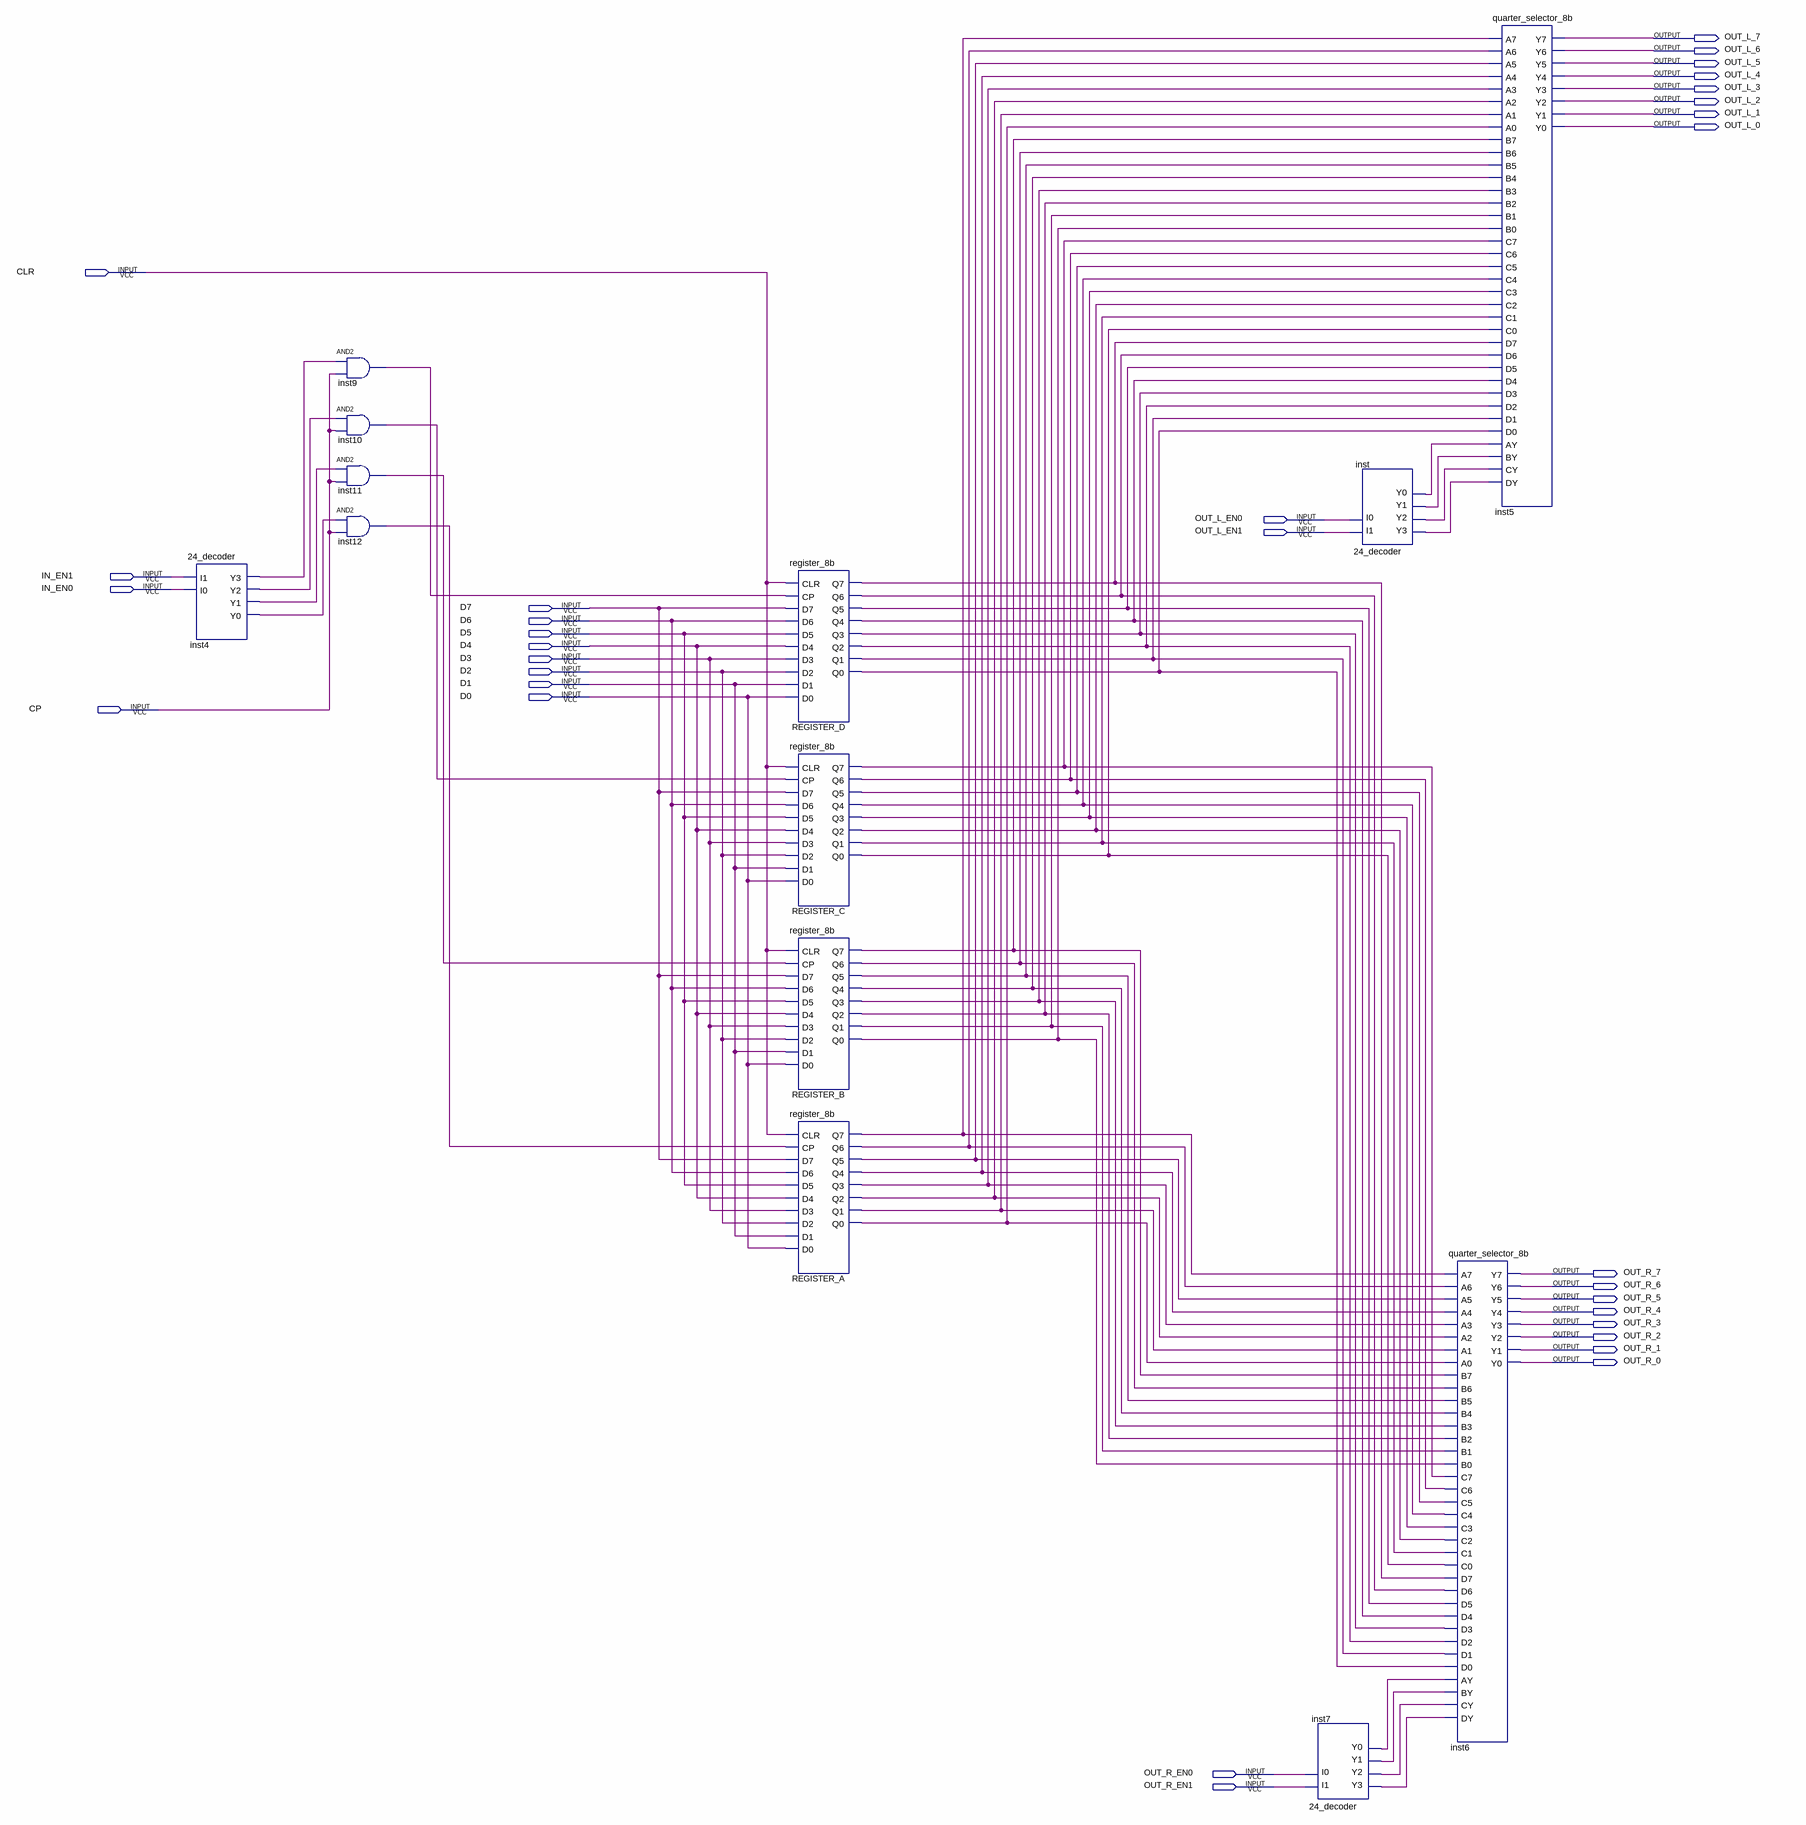
[diagram p0: schematic sheet]
// Quartus schematic register_4x.bdf as structural Verilog: 13 symbols, 32 pins
module register_4x (
  input  CLR,
  input  OUT_L_EN0,
  input  OUT_L_EN1,
  input  IN_EN1,
  input  IN_EN0,
  input  D7,
  input  D6,
  input  D5,
  input  D4,
  input  D3,
  input  D2,
  input  D1,
  input  D0,
  input  CP,
  input  OUT_R_EN0,
  input  OUT_R_EN1,
  output OUT_L_7,
  output OUT_L_6,
  output OUT_L_5,
  output OUT_L_4,
  output OUT_L_3,
  output OUT_L_2,
  output OUT_L_1,
  output OUT_L_0,
  output OUT_R_7,
  output OUT_R_6,
  output OUT_R_5,
  output OUT_R_4,
  output OUT_R_3,
  output OUT_R_2,
  output OUT_R_1,
  output OUT_R_0
);

  wire inst4_y0, inst4_y1, inst4_y2, inst4_y3, inst7_y0, inst7_y1, inst7_y2, inst7_y3, inst9_out, inst10_out,
       inst11_out, inst12_out, inst_y0, inst_y1, inst_y2, inst_y3, REGISTER_A_q0, REGISTER_A_q1,
       REGISTER_A_q2, REGISTER_A_q3, REGISTER_A_q4, REGISTER_A_q5, REGISTER_A_q6, REGISTER_A_q7,
       REGISTER_B_q0, REGISTER_B_q1, REGISTER_B_q2, REGISTER_B_q3, REGISTER_B_q4, REGISTER_B_q5,
       REGISTER_B_q6, REGISTER_B_q7, REGISTER_C_q0, REGISTER_C_q1, REGISTER_C_q2, REGISTER_C_q3,
       REGISTER_C_q4, REGISTER_C_q5, REGISTER_C_q6, REGISTER_C_q7, REGISTER_D_q0, REGISTER_D_q1,
       REGISTER_D_q2, REGISTER_D_q3, REGISTER_D_q4, REGISTER_D_q5, REGISTER_D_q6, REGISTER_D_q7;

  \24_decoder  inst4 (.I1(IN_EN1), .I0(IN_EN0), .Y3(inst4_y3), .Y2(inst4_y2), .Y1(inst4_y1), .Y0(inst4_y0));
  and inst9 (inst9_out, inst4_y3, CP);
  and inst10 (inst10_out, inst4_y2, CP);
  and inst11 (inst11_out, inst4_y1, CP);
  and inst12 (inst12_out, inst4_y0, CP);
  register_8b REGISTER_D (
    .CLR(CLR), .CP(inst9_out), .D7(D7), .D6(D6), .D5(D5), .D4(D4), .D3(D3), .D2(D2), .D1(D1), .D0(D0),
    .Q7(REGISTER_D_q7), .Q6(REGISTER_D_q6), .Q5(REGISTER_D_q5), .Q4(REGISTER_D_q4), .Q3(REGISTER_D_q3),
    .Q2(REGISTER_D_q2), .Q1(REGISTER_D_q1), .Q0(REGISTER_D_q0));
  register_8b REGISTER_C (
    .CLR(CLR), .CP(inst10_out), .D7(D7), .D6(D6), .D5(D5), .D4(D4), .D3(D3), .D2(D2), .D1(D1), .D0(D0),
    .Q7(REGISTER_C_q7), .Q6(REGISTER_C_q6), .Q5(REGISTER_C_q5), .Q4(REGISTER_C_q4), .Q3(REGISTER_C_q3),
    .Q2(REGISTER_C_q2), .Q1(REGISTER_C_q1), .Q0(REGISTER_C_q0));
  register_8b REGISTER_B (
    .CLR(CLR), .CP(inst11_out), .D7(D7), .D6(D6), .D5(D5), .D4(D4), .D3(D3), .D2(D2), .D1(D1), .D0(D0),
    .Q7(REGISTER_B_q7), .Q6(REGISTER_B_q6), .Q5(REGISTER_B_q5), .Q4(REGISTER_B_q4), .Q3(REGISTER_B_q3),
    .Q2(REGISTER_B_q2), .Q1(REGISTER_B_q1), .Q0(REGISTER_B_q0));
  register_8b REGISTER_A (
    .CLR(CLR), .CP(inst12_out), .D7(D7), .D6(D6), .D5(D5), .D4(D4), .D3(D3), .D2(D2), .D1(D1), .D0(D0),
    .Q7(REGISTER_A_q7), .Q6(REGISTER_A_q6), .Q5(REGISTER_A_q5), .Q4(REGISTER_A_q4), .Q3(REGISTER_A_q3),
    .Q2(REGISTER_A_q2), .Q1(REGISTER_A_q1), .Q0(REGISTER_A_q0));
  \24_decoder  inst7 (.I1(OUT_R_EN1), .I0(OUT_R_EN0), .Y3(inst7_y3), .Y2(inst7_y2), .Y1(inst7_y1), .Y0(inst7_y0));
  \24_decoder  inst (.I1(OUT_L_EN1), .I0(OUT_L_EN0), .Y3(inst_y3), .Y2(inst_y2), .Y1(inst_y1), .Y0(inst_y0));
  quarter_selector_8b inst6 (
    .A7(REGISTER_A_q7), .A6(REGISTER_A_q6), .A5(REGISTER_A_q5), .A4(REGISTER_A_q4), .A3(REGISTER_A_q3),
    .A2(REGISTER_A_q2), .A1(REGISTER_A_q1), .A0(REGISTER_A_q0), .B7(REGISTER_B_q7), .B6(REGISTER_B_q6),
    .B5(REGISTER_B_q5), .B4(REGISTER_B_q4), .B3(REGISTER_B_q3), .B2(REGISTER_B_q2), .B1(REGISTER_B_q1),
    .B0(REGISTER_B_q0), .AY(inst7_y0), .BY(inst7_y1), .C7(REGISTER_C_q7), .C6(REGISTER_C_q6),
    .C5(REGISTER_C_q5), .C4(REGISTER_C_q4), .C3(REGISTER_C_q3), .C2(REGISTER_C_q2), .C1(REGISTER_C_q1),
    .C0(REGISTER_C_q0), .D7(REGISTER_D_q7), .D6(REGISTER_D_q6), .D5(REGISTER_D_q5), .D4(REGISTER_D_q4),
    .D3(REGISTER_D_q3), .D2(REGISTER_D_q2), .D1(REGISTER_D_q1), .D0(REGISTER_D_q0), .CY(inst7_y2),
    .DY(inst7_y3), .Y7(OUT_R_7), .Y6(OUT_R_6), .Y5(OUT_R_5), .Y4(OUT_R_4), .Y3(OUT_R_3), .Y2(OUT_R_2),
    .Y1(OUT_R_1), .Y0(OUT_R_0));
  quarter_selector_8b inst5 (
    .A7(REGISTER_A_q7), .A6(REGISTER_A_q6), .A5(REGISTER_A_q5), .A4(REGISTER_A_q4), .A3(REGISTER_A_q3),
    .A2(REGISTER_A_q2), .A1(REGISTER_A_q1), .A0(REGISTER_A_q0), .B7(REGISTER_B_q7), .B6(REGISTER_B_q6),
    .B5(REGISTER_B_q5), .B4(REGISTER_B_q4), .B3(REGISTER_B_q3), .B2(REGISTER_B_q2), .B1(REGISTER_B_q1),
    .B0(REGISTER_B_q0), .AY(inst_y0), .BY(inst_y1), .C7(REGISTER_C_q7), .C6(REGISTER_C_q6),
    .C5(REGISTER_C_q5), .C4(REGISTER_C_q4), .C3(REGISTER_C_q3), .C2(REGISTER_C_q2), .C1(REGISTER_C_q1),
    .C0(REGISTER_C_q0), .D7(REGISTER_D_q7), .D6(REGISTER_D_q6), .D5(REGISTER_D_q5), .D4(REGISTER_D_q4),
    .D3(REGISTER_D_q3), .D2(REGISTER_D_q2), .D1(REGISTER_D_q1), .D0(REGISTER_D_q0), .CY(inst_y2),
    .DY(inst_y3), .Y7(OUT_L_7), .Y6(OUT_L_6), .Y5(OUT_L_5), .Y4(OUT_L_4), .Y3(OUT_L_3), .Y2(OUT_L_2),
    .Y1(OUT_L_1), .Y0(OUT_L_0));
endmodule
